# EAGLE schematic stm32 (EAGLE 8.6.0)
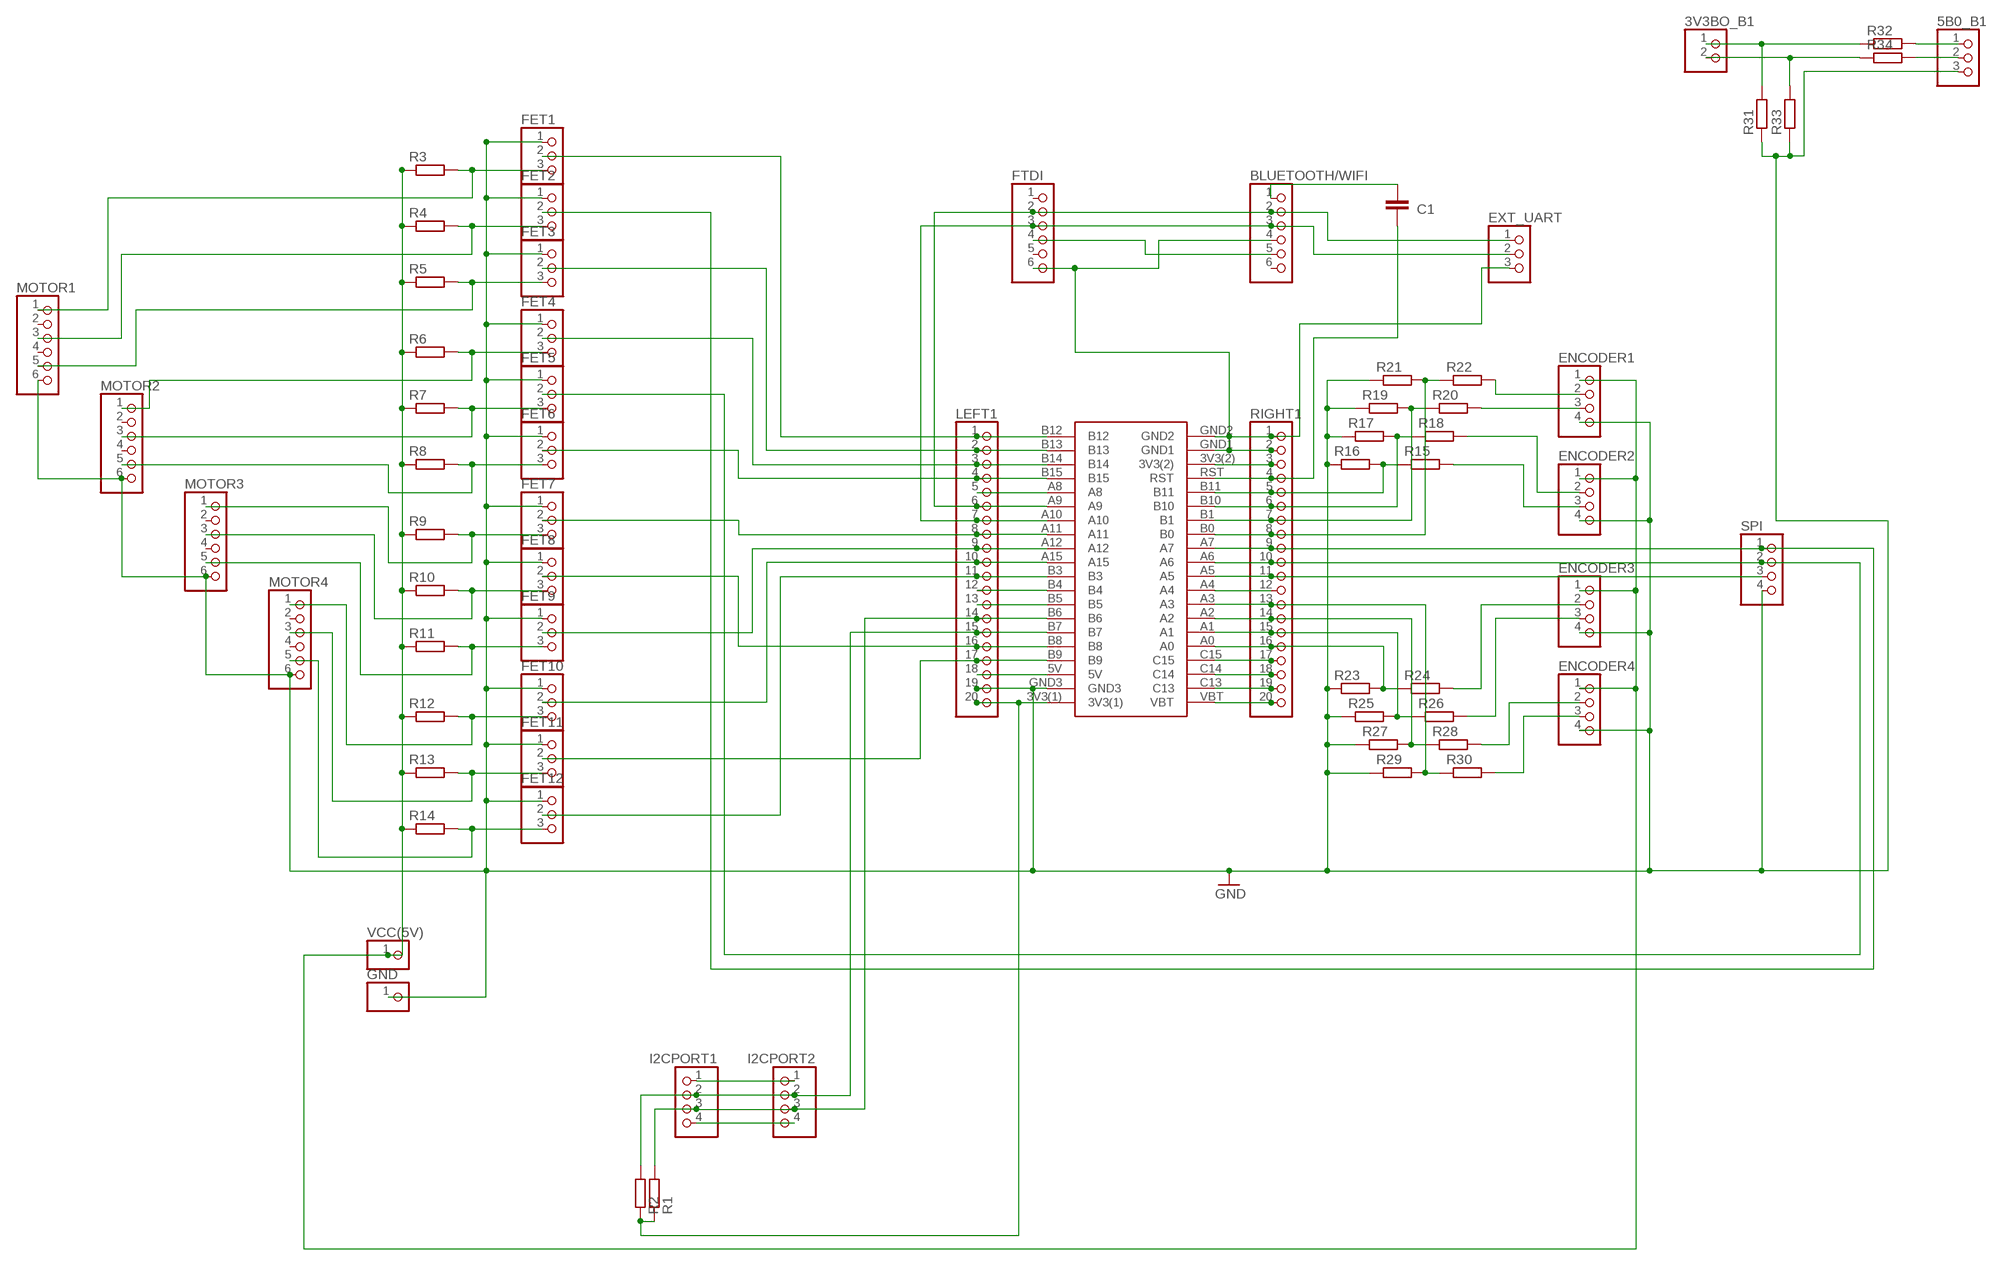
[diagram p0: schematic, sheet 1]

## Parts
3V3BO_B1  PINHD-1X2  [1X02]
5B0_B1  PINHD-1X3  [1X03]
BLUETOOTH/WIFI  PINHD-1X6  [1X06]
C1  C-EU025-030X050  [C025-030X050]
ENCODER1  PINHD-1X4  [1X04]
ENCODER2  PINHD-1X4  [1X04]
ENCODER3  PINHD-1X4  [1X04]
ENCODER4  PINHD-1X4  [1X04]
EXT_UART  PINHD-1X3  [1X03]
FET1  PINHD-1X3  [1X03]
FET2  PINHD-1X3  [1X03]
FET3  PINHD-1X3  [1X03]
FET4  PINHD-1X3  [1X03]
FET5  PINHD-1X3  [1X03]
FET6  PINHD-1X3  [1X03]
FET7  PINHD-1X3  [1X03]
FET8  PINHD-1X3  [1X03]
FET9  PINHD-1X3  [1X03]
FET10  PINHD-1X3  [1X03]
FET11  PINHD-1X3  [1X03]
FET12  PINHD-1X3  [1X03]
FTDI  PINHD-1X6  [1X06]
GND  PINHD-1X1  [1X01]
I2CPORT1  PINHD-1X4  [1X04]
I2CPORT2  PINHD-1X4  [1X04]
LEFT1  PINHD-1X20  [1X20]
MOTOR1  PINHD-1X6  [1X06]
MOTOR2  PINHD-1X6  [1X06]
MOTOR3  PINHD-1X6  [1X06]
MOTOR4  PINHD-1X6  [1X06]
R1  R-EU_0204/5  [0204/5]
R2  R-EU_0204/5  [0204/5]
R3  R-EU_0204/5  [0204/5]
R4  R-EU_0204/5  [0204/5]
R5  R-EU_0204/5  [0204/5]
R6  R-EU_0204/5  [0204/5]
R7  R-EU_0204/5  [0204/5]
R8  R-EU_0204/5  [0204/5]
R9  R-EU_0204/5  [0204/5]
R10  R-EU_0204/5  [0204/5]
R11  R-EU_0204/5  [0204/5]
R12  R-EU_0204/5  [0204/5]
R13  R-EU_0204/5  [0204/5]
R14  R-EU_0204/5  [0204/5]
R15  R-EU_0204/5  [0204/5]
R16  R-EU_0204/5  [0204/5]
R17  R-EU_0204/5  [0204/5]
R18  R-EU_0204/5  [0204/5]
R19  R-EU_0204/5  [0204/5]
R20  R-EU_0204/5  [0204/5]
R21  R-EU_0204/5  [0204/5]
R22  R-EU_0204/5  [0204/5]
R23  R-EU_0204/5  [0204/5]
R24  R-EU_0204/5  [0204/5]
R25  R-EU_0204/5  [0204/5]
R26  R-EU_0204/5  [0204/5]
R27  R-EU_0204/5  [0204/5]
R28  R-EU_0204/5  [0204/5]
R29  R-EU_0204/5  [0204/5]
R30  R-EU_0204/5  [0204/5]
R31  R-EU_0204/5  [0204/5]
R32  R-EU_0204/5  [0204/5]
R33  R-EU_0204/5  [0204/5]
R34  R-EU_0204/5  [0204/5]
RIGHT1  PINHD-1X20  [1X20]
SPI  PINHD-1X4  [1X04]
U$1  STM32THROUGH_HOLE  [STM32]
VCC(5V)  PINHD-1X1  [1X01]

## Nets
5V: ENCODER1.1 ENCODER2.1 ENCODER3.1 ENCODER4.1 R3.1 R4.1 R5.1 R6.1 R7.1 R8.1 R9.1 R10.1 R11.1 R12.1 R13.1 R14.1 VCC(5V).1
B0: ENCODER1.2 R22.2
B1: ENCODER1.3 R20.2
GND: 5B0_B1.3 ENCODER1.4 ENCODER2.4 ENCODER3.4 ENCODER4.4 FET1.1 FET2.1 FET3.1 FET4.1 FET5.1 FET6.1 FET7.1 FET8.1 FET9.1 FET10.1 FET11.1 FET12.1 GND.1 LEFT1.19 MOTOR1.6 MOTOR2.6 MOTOR3.6 MOTOR4.6 R16.1 R17.1 R19.1 R21.1 R23.1 R25.1 R27.1 R29.1 R31.1 R33.1 SPI.4 U$1.GND3
N$1: 3V3BO_B1.1 R31.2 R32.1
N$2: FET3.2 LEFT1.2 U$1.B13
N$3: LEFT1.20 R1.1 R2.1 U$1.3V3(1)
N$4: FET4.2 LEFT1.3 U$1.B14
N$5: FET6.2 LEFT1.4 U$1.B15
N$6: LEFT1.5 U$1.A8
N$7: BLUETOOTH/WIFI.2 EXT_UART.1 FTDI.2 LEFT1.6 U$1.A9
N$8: LEFT1.18 U$1.5V
N$9: BLUETOOTH/WIFI.3 EXT_UART.2 FTDI.3 LEFT1.7 U$1.A10
N$10: BLUETOOTH/WIFI.5 FTDI.4
N$11: FET10.2 LEFT1.10 U$1.A15
N$12: FET7.2 LEFT1.8 U$1.A11
N$13: FET9.2 LEFT1.9 U$1.A12
N$14: BLUETOOTH/WIFI.1 C1.2
N$15: FET12.2 LEFT1.11 U$1.B3
N$16: I2CPORT1.2 I2CPORT2.2 LEFT1.15 R2.2 U$1.B7
N$17: FET8.2 LEFT1.16 U$1.B8
N$18: FET11.2 LEFT1.17 U$1.B9
N$19: LEFT1.12 U$1.B4
N$20: BLUETOOTH/WIFI.4 EXT_UART.3 FTDI.6 RIGHT1.1 RIGHT1.2 U$1.GND1 U$1.GND2
N$21: 3V3BO_B1.2 R33.2 R34.1
N$22: RIGHT1.20 U$1.VBT
N$23: RIGHT1.19 U$1.C13
N$24: RIGHT1.18 U$1.C14
N$25: RIGHT1.17 U$1.C15
N$26: R23.2 R24.1 RIGHT1.16 U$1.A0
N$27: I2CPORT1.1 I2CPORT2.1
N$28: R25.2 R26.1 RIGHT1.15 U$1.A1
N$29: R27.2 R28.1 RIGHT1.14 U$1.A2
N$30: I2CPORT1.3 I2CPORT2.3 LEFT1.14 R1.2 U$1.B6
N$31: R29.2 R30.1 RIGHT1.13 U$1.A3
N$32: RIGHT1.12 U$1.A4
N$33: RIGHT1.11 SPI.3 U$1.A5
N$34: 5B0_B1.1 R32.2
N$35: FET5.2 RIGHT1.10 SPI.2 U$1.A6
N$36: 5B0_B1.2 R34.2
N$37: R21.2 R22.1 RIGHT1.8 U$1.B0
N$39: R17.2 R18.1 RIGHT1.6 U$1.B10
N$40: I2CPORT1.4 I2CPORT2.4
N$43: RIGHT1.3 U$1.3V3(2)
N$44: C1.1 RIGHT1.4 U$1.RST
N$45: R15.1 R16.2 RIGHT1.5 U$1.B11
N$46: FET1.2 LEFT1.1 U$1.B12
N$47: LEFT1.13 U$1.B5
N$48: FET1.3 MOTOR1.1 R3.2
N$49: FET2.3 MOTOR1.3 R4.2
N$50: FET3.3 MOTOR1.5 R5.2
N$51: FET4.3 MOTOR2.1 R6.2
N$52: FET5.3 MOTOR2.3 R7.2
N$53: FET6.3 MOTOR2.5 R8.2
N$54: FET7.3 MOTOR3.1 R9.2
N$55: FET8.3 MOTOR3.3 R10.2
N$56: FET9.3 MOTOR3.5 R11.2
N$57: FET11.3 MOTOR4.3 R13.2
N$58: FET10.3 MOTOR4.1 R12.2
N$59: FET12.3 MOTOR4.5 R14.2
N$60: FET2.2 RIGHT1.9 SPI.1 U$1.A7
N$63: R19.2 R20.1 RIGHT1.7 U$1.B1
N$65: ENCODER3.2 R24.2
N$66: ENCODER3.3 R26.2
N$67: ENCODER4.2 R28.2
N$68: ENCODER4.3 R30.2
N$73: ENCODER2.2 R18.2
N$74: ENCODER2.3 R15.2
Unconnected: BLUETOOTH/WIFI.6 FTDI.1 FTDI.5 MOTOR1.2 MOTOR1.4 MOTOR2.2 MOTOR2.4 MOTOR3.2 MOTOR3.4 MOTOR4.2 MOTOR4.4

## Library data of the parts
3V3BO_B1 = pinhead:PINHD-1X2: PIN HEADER
5B0_B1 EXT_UART FET1-FET12 = pinhead:PINHD-1X3: PIN HEADER
BLUETOOTH/WIFI FTDI MOTOR1-MOTOR4 = pinhead:PINHD-1X6: PIN HEADER
C1 = resistor:C-EU: CAPACITOR, European symbol
ENCODER1-ENCODER4 I2CPORT1 I2CPORT2 SPI = pinhead:PINHD-1X4: PIN HEADER
GND VCC(5V) = pinhead:PINHD-1X1: PIN HEADER
LEFT1 RIGHT1 = pinhead:PINHD-1X20: PIN HEADER
R1-R34 = resistor:R-EU_: RESISTOR, European symbol
U$1 = stm32:STM32